# Altium schematic sheet COMRAD_TOP_LEVEL.SchDoc
size A4; DocumentNumber: 1; SheetNumber: 1; SheetTotal: 47
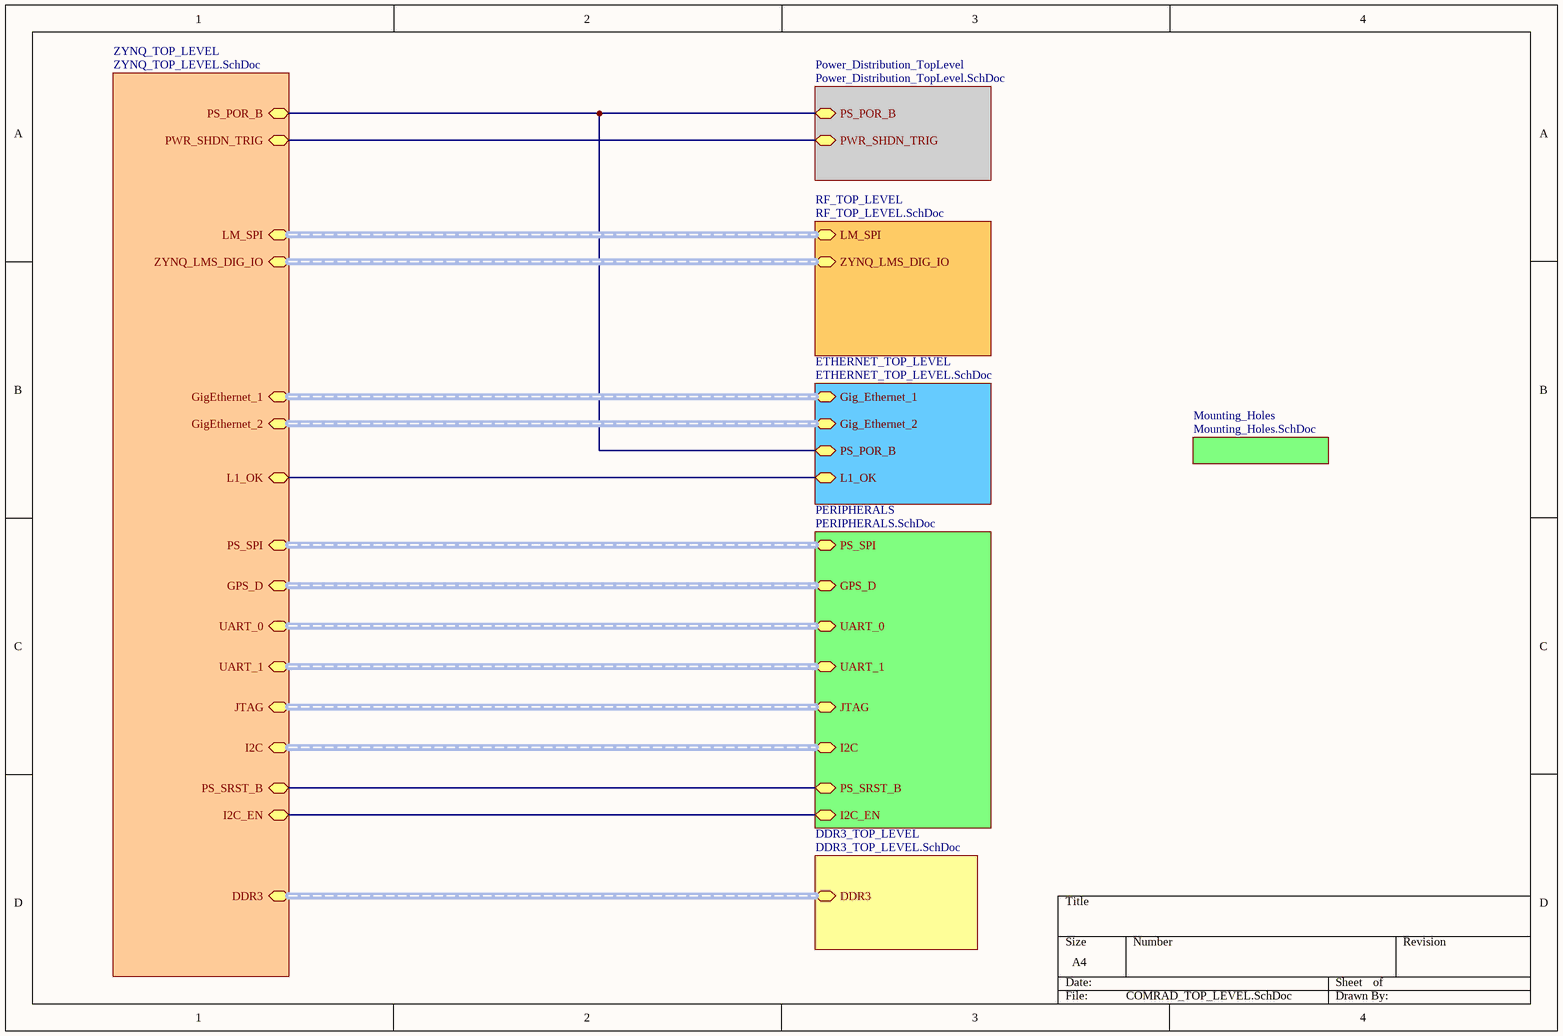
[diagram p0: COMRAD_TOP_LEVEL.SchDoc]

## Sub-sheets
DDR3_TOP_LEVEL = DDR3_TOP_LEVEL.SchDoc: DDR3 (harness DDR3)
ETHERNET_TOP_LEVEL = ETHERNET_TOP_LEVEL.SchDoc: Gig_Ethernet_1 (harness Gig_Ethernet1), Gig_Ethernet_2 (harness Gig_Ethernet2), PS_POR_B (bidir), L1_OK
Mounting_Holes = Mounting_Holes.SchDoc: no entries
PERIPHERALS = PERIPHERALS.SchDoc: PS_SPI (harness SPI), GPS_D (harness GPS), UART_0 (harness UART_0), JTAG (harness JTAG), UART_1 (harness UART_1), I2C (harness I2C), PS_SRST_B (bidir), I2C_EN (bidir)
Power_Distribution_TopLevel = Power_Distribution_TopLevel.SchDoc: PS_POR_B (bidir), PWR_SHDN_TRIG (bidir)
RF_TOP_LEVEL = RF_TOP_LEVEL.SchDoc: LM_SPI (harness LM_SPI), ZYNQ_LMS_DIG_IO (harness DIG_IO)
ZYNQ_TOP_LEVEL = ZYNQ_TOP_LEVEL.SchDoc: DDR3 (harness DDR3), PS_SPI (harness SPI), UART_0 (harness UART_0), GigEthernet_1 (harness Gig_Ethernet1), GigEthernet_2 (harness Gig_Ethernet2), JTAG (harness JTAG), ZYNQ_LMS_DIG_IO (harness DIG_IO), LM_SPI (harness LM_SPI), GPS_D (harness GPS), PS_POR_B (bidir), UART_1 (harness UART_1), I2C (harness I2C), PS_SRST_B (bidir), PWR_SHDN_TRIG (bidir), I2C_EN (bidir), L1_OK

## Nets
(unnamed): sheet ZYNQ_TOP_LEVEL/PS_POR_B, sheet ETHERNET_TOP_LEVEL/PS_POR_B, sheet Power_Distribution_TopLevel/PS_POR_B
(unnamed): sheet ZYNQ_TOP_LEVEL/PS_SRST_B, sheet PERIPHERALS/PS_SRST_B
(unnamed): sheet ZYNQ_TOP_LEVEL/PWR_SHDN_TRIG, sheet Power_Distribution_TopLevel/PWR_SHDN_TRIG
(unnamed): sheet ZYNQ_TOP_LEVEL/I2C_EN, sheet PERIPHERALS/I2C_EN
(unnamed): sheet ZYNQ_TOP_LEVEL/L1_OK, sheet ETHERNET_TOP_LEVEL/L1_OK

## Buses and harness runs
harness sheet DDR3_TOP_LEVEL/DDR3 = sheet ZYNQ_TOP_LEVEL/DDR3
harness sheet ETHERNET_TOP_LEVEL/Gig_Ethernet_1 = sheet ZYNQ_TOP_LEVEL/GigEthernet_1
harness sheet ETHERNET_TOP_LEVEL/Gig_Ethernet_2 = sheet ZYNQ_TOP_LEVEL/GigEthernet_2
harness sheet PERIPHERALS/GPS_D = sheet ZYNQ_TOP_LEVEL/GPS_D
harness sheet PERIPHERALS/I2C = sheet ZYNQ_TOP_LEVEL/I2C
harness sheet PERIPHERALS/JTAG = sheet ZYNQ_TOP_LEVEL/JTAG
harness sheet PERIPHERALS/PS_SPI = sheet ZYNQ_TOP_LEVEL/PS_SPI
harness sheet PERIPHERALS/UART_0 = sheet ZYNQ_TOP_LEVEL/UART_0
harness sheet PERIPHERALS/UART_1 = sheet ZYNQ_TOP_LEVEL/UART_1
harness sheet RF_TOP_LEVEL/LM_SPI = sheet ZYNQ_TOP_LEVEL/LM_SPI
harness sheet RF_TOP_LEVEL/ZYNQ_LMS_DIG_IO = sheet ZYNQ_TOP_LEVEL/ZYNQ_LMS_DIG_IO